# EAGLE design shield_draft (EAGLE 9.6.2)
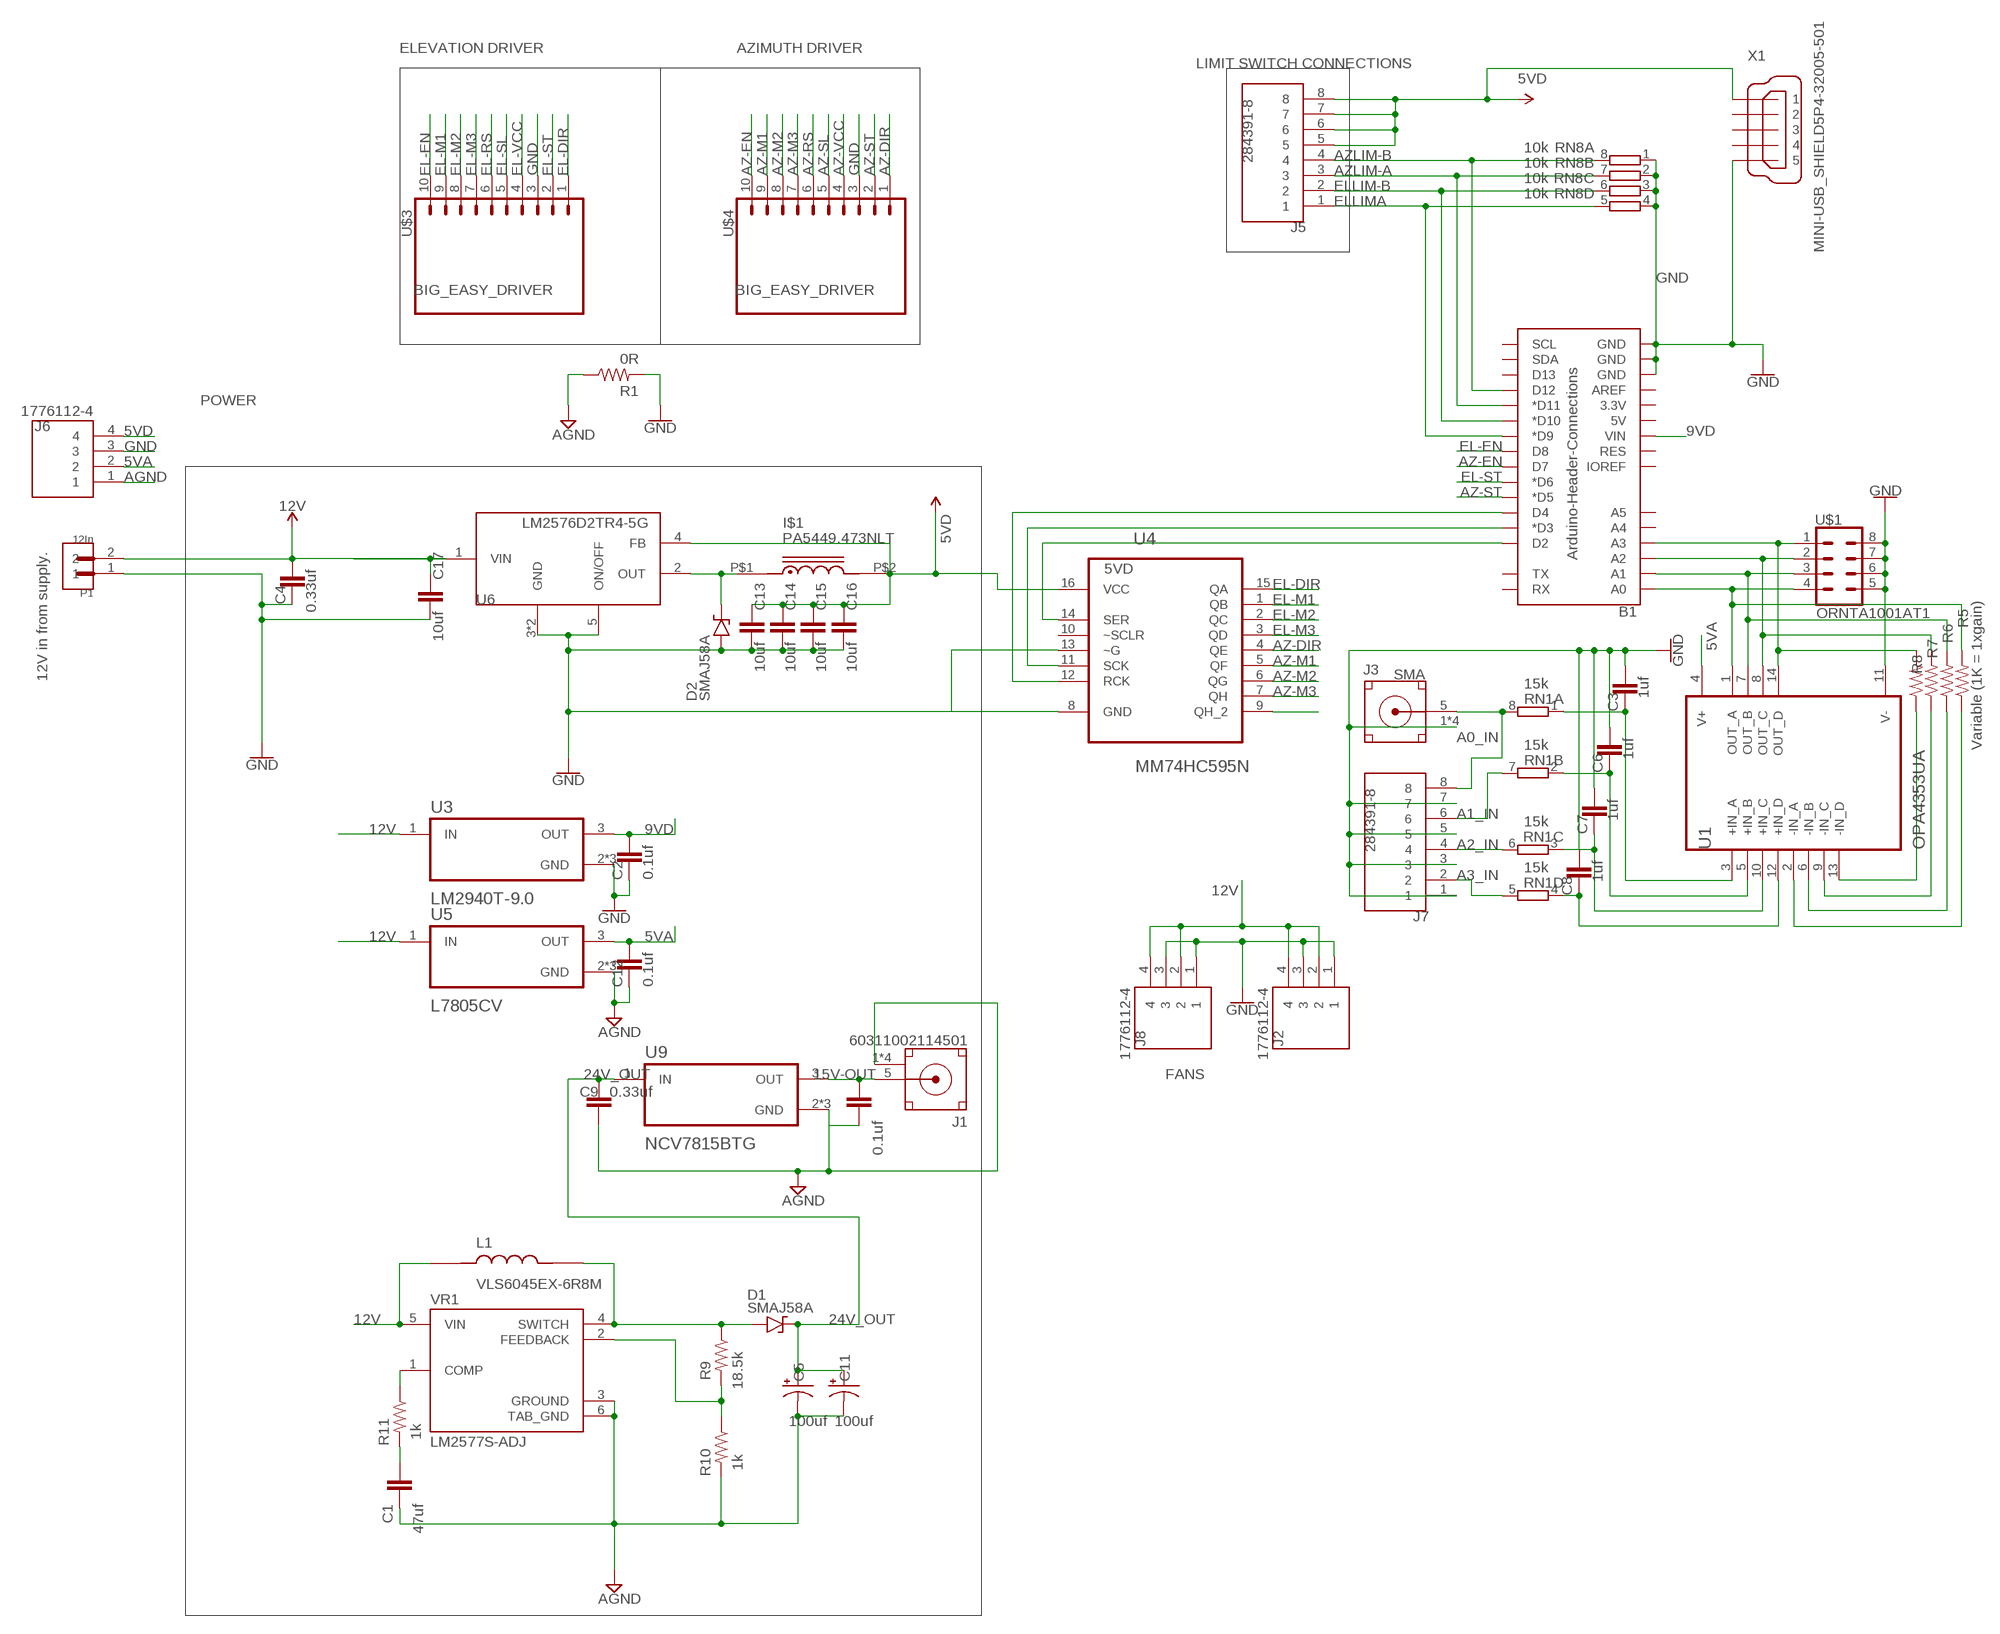
[diagram p0: schematic, sheet 1]

## Parts
B1  Arduino-Header-Connections  ARDUINO_UNO_R3_SHIELDBASIC  [UNO_R3_SHIELD]
C1  47uf  CC0805KRX7R9BB104  [CAP_0805]
C2  0.1uf  CC0805KRX7R9BB104  [CAP_0805]
C3  1uf  CC0805KRX7R9BB104  [CAP_0805]
C4  0.33uf  CC0805KRX7R9BB104  [CAP_0805]
C5  100uf  CAPACITOR-PE5-10.5  [E5-10,5]
C6  1uf  CC0805KRX7R9BB104  [CAP_0805]
C7  1uf  CC0805KRX7R9BB104  [CAP_0805]
C8  1uf  CC0805KRX7R9BB104  [CAP_0805]
C9  0.33uf  CC0805KRX7R9BB104  [CAP_0805]
C10  0.1uf  CC0805KRX7R9BB104  [CAP_0805]
C11  100uf  CAPACITOR-PE5-10.5  [E5-10,5]
C12  0.1uf  CC0805KRX7R9BB104  [CAP_0805]
C13  10uf  39NF-0805-50V-10%  [0805]
C14  10uf  39NF-0805-50V-10%  [0805]
C15  10uf  39NF-0805-50V-10%  [0805]
C16  10uf  39NF-0805-50V-10%  [0805]
C17  10uf  39NF-0805-50V-10%  [0805]
D1  SMAJ58A  [SMA]
D2  SMAJ58A  [SMA]
I$1  PA5449.473NLT  PULSE_ELECTRONICS_INDUCTOR  [IND_TYS4020470M-10]
J1  60311002114501  [60311002114501]
J2  1776112-4  [TE_1776112-4]
J3  SMA  60311002114501  [60311002114501]
J5  284391-8  [TE_284391-8]
J6  1776112-4  [TE_1776112-4]
J7  284391-8  [TE_284391-8]
J8  1776112-4  [TE_1776112-4]
L1  VLS6045EX-6R8M  [IND_VLS6045EX-6R8M]
P1  12In  OSTTE020104  [OST_OSTTE020104]
R1  0R  1OHM-0603-1/10W-1%  [0603]
R5  Variable (1K = 1xgain)  R-US_AXIAL-11.7MM-PITCH  [RESAD1176W63L850D250B]
R6  Var  R-US_AXIAL-11.7MM-PITCH  [RESAD1176W63L850D250B]
R7  Var  R-US_AXIAL-11.7MM-PITCH  [RESAD1176W63L850D250B]
R8  Var  R-US_AXIAL-11.7MM-PITCH  [RESAD1176W63L850D250B]
R9  18.5k  1OHM-0603-1/10W-1%  [0603]
R10  1k  1OHM-0603-1/10W-1%  [0603]
R11  1k  1OHM-0603-1/10W-1%  [0603]
RN1  15k  0016_064R_10K_/_CAY16-103J4LF  [CAY16]
RN8  10k  0016_064R_10K_/_CAY16-103J4LF  [CAY16]
U1  OPA4353UA  [SOIC127P600X175-14N]
U3  LM2940T-9.0  [TO254P1054X470X1955-3]
U4  MM74HC595N  [DIP254P762X533-16]
U5  L7805CV  LM2940T-9.0  [TO254P1054X470X1955-3]
U6  LM2576D2TR4-5G  [D2PAK-5]
U9  NCV7815BTG  LM2940T-9.0  [TO254P1054X470X1955-3]
U$1  ORNTA1001AT1  [SOIC127P600X175-8N]
U$3  BIG_EASY_DRIVER  [EASY_DRIVER_FTPRT]
U$4  BIG_EASY_DRIVER  [EASY_DRIVER_FTPRT]
VR1  LM2577S-ADJ  [TO170P1524X483-6N]
X1  MINI-USB_SHIELD5P4-32005-501  [32005-501]

## Nets
5VA: C12.2 J6.2 U1.4(V+) U5.3(OUT)
5VD: C13.1 C14.1 C15.1 C16.1 I$1.P$2 J5.5 J5.6 J5.7 J5.8 J6.4 U4.16(VCC) U6.4(FB) X1.1 ; supply symbol labelled 5V
9VD: B1.VIN C2.2 U3.3(OUT)
12V: C4.2 C17.1 J2.2 J2.4 J8.2 J8.4 L1.1 P1.2 U3.1(IN) U5.1(IN) U6.1(VIN) VR1.5(VIN)
15V-OUT: C10.2 J1.5(SIGNAL) U9.3(OUT)
24V_OUT: C5.+ C9.2 C11.+ D1.C U9.1(IN)
24V_PRE: D1.A L1.2 R9.1 VR1.4(SWITCH)
A0_IN: J3.5(SIGNAL) J7.8 RN1.8
A1_IN: J7.6 RN1.7
A2_IN: J7.4 RN1.6
A3_IN: J7.2 RN1.5
A_OUT: B1.A0 R5.2 U1.1(OUT_A) U$1.4(R4A)
AGND: C1.1 C5.- C9.1 C10.1 C11.- C12.1 J1.1(GND) J1.2(GND) J1.3(GND) J1.4(GND) J6.1 R1.1 R10.2 U5.2(GND) U5.P$1(GND) U5.P$2(GND) U9.2(GND) U9.P$1(GND) U9.P$2(GND) VR1.3(GROUND) VR1.6(TAB_GND)
AIN+: C3.1 RN1.1 U1.3(+IN_A)
AIN-: R5.1 U1.2(-IN_A)
AZ-DIR: U4.4(QE) U$4.1
AZ-EN: B1.D7 U$4.10
AZ-M1: U4.5(QF) U$4.9
AZ-M2: U4.6(QG) U$4.8
AZ-M3: U4.7(QH) U$4.7
AZ-RS: U$4.6
AZ-SL: U$4.5
AZ-ST: B1.D5(*D5) U$4.2
AZ-VCC: U$4.4
AZLIM-A: B1.D11(*D11) J5.3 RN8.7
AZLIM-B: B1.D12 J5.4 RN8.8
B_OUT: B1.A1 R6.2 U1.7(OUT_B) U$1.3(R3A)
BIN+: C6.1 RN1.2 U1.5(+IN_B)
BIN-: R6.1 U1.6(-IN_B)
C_OUT: B1.A2 R7.2 U1.8(OUT_C) U$1.2(R2A)
CIN+: C7.1 RN1.3 U1.10(+IN_C)
CIN-: R7.1 U1.9(-IN_C)
D_OUT: B1.A3 R8.2 U1.14(OUT_D) U$1.1(R1A)
DIN+: C8.1 RN1.4 U1.12(+IN_D)
DIN-: R8.1 U1.13(-IN_D)
EL-DIR: U4.15(QA) U$3.1
EL-EN: B1.D8 U$3.10
EL-M1: U4.1(QB) U$3.9
EL-M2: U4.2(QC) U$3.8
EL-M3: U4.3(QD) U$3.7
EL-RS: U$3.6
EL-SL: U$3.5
EL-ST: B1.D6(*D6) U$3.2
EL-VCC: U$3.4
ELLIM-B: B1.D10(*D10) J5.2 RN8.6
ELLIMA: B1.D9(*D9) J5.1 RN8.5
GND: B1.GND@0(GND) B1.GND@1(GND) B1.GND@2(GND) C2.1 C3.2 C4.1 C6.2 C7.2 C8.2 C13.2 C14.2 C15.2 C16.2 C17.2 D2.A J2.1 J2.3 J3.1(GND) J3.2(GND) J3.3(GND) J3.4(GND) J6.3 J7.1 J7.3 J7.5 J7.7 J8.1 J8.3 P1.1 R1.2 RN8.1 RN8.2 RN8.3 RN8.4 U1.11(V-) U3.2(GND) U3.P$1(GND) U3.P$2(GND) U4.8(GND) U4.13(~G) U6.3(GND) U6.5(ON/OFF) U6.6(GND) U$1.5(R4B) U$1.6(R3B) U$1.7(R2B) U$1.8(R1B) U$3.3 U$4.3 X1.5
N$1: B1.D2 U4.14(SER)
N$4: R9.2 R10.1 VR1.2(FEEDBACK)
N$5: D2.C I$1.P$1 U6.2(OUT)
N$6: R11.1 VR1.1(COMP)
N$7: C1.2 R11.2
N$10: B1.D3(*D3) U4.11(SCK)
N$11: B1.D4 U4.12(RCK)
N$12: U4.9(QH_2)
Unconnected: B1.3.3V B1.5V B1.A4 B1.A5 B1.AREF B1.D13 B1.IOREF B1.RES B1.RX B1.SCL B1.SDA B1.TX U4.10(~SCLR) X1.2 X1.3 X1.4 X1.M1(S1) X1.M2(S2) X1.M3(S3) X1.M4(S4)

## Notes on the sheet
- ELEVATION DRIVER | AZIMUTH DRIVER
- LIMIT SWITCH CONNECTIONS
- POWER
- 12V in from supply.
- FANS

## Library data of the parts
B1 = SparkFun-Boards:ARDUINO_UNO_R3_SHIELD: Arduino R3 Shield Footprint Shield form compatible with the Arduino Uno R3. SparkFun Products: MG2639 Cellular Shield <https://www.sparkfun.com/products/13120> MIDI Shield <https://www.sparkfun.com/products/12898> R3 Stackable Headers Kit <https://www.sparkfun.com/products/11417>
C1-C4 C6-C10 C12 = Resistor_Capacitor:CC0805KRX7R9BB104: CAP CER 0.1UF 50V X7R 0805 Manufacturer's datasheet <http://www.yageo.com/documents/recent/UPY-GPHC_X7R_6.3V-to-50V_18.pdf>; CREATED_BY: PCBLayout.com; DIGIKEY_PART_NUMBER: 311-1140-2-ND; MANUFACTURER: Yageo; MPN: CC0805KRX7R9BB104; PACKAGE: SMD 0805
C5 C11 = BeagleBone_Blue_R3:CAPACITOR-P: POLARIZED CAPACITOR, American symbol
C13-C17 = SparkFun-Capacitors:39NF: 39nF ceramic capacitors A capacitor is a passive two-terminal electrical component used to store electrical energy temporarily in an electric field.; PROD_ID: CAP-15816; VALUE: 39nF
D1 D2 = SMAJ58A:SMAJ58A: Check prices <https://pricing.snapeda.com/parts/SMAJ58A/Littelfuse%20Inc./view-part?ref=eda>; AVAILABILITY: Good; DESCRIPTION: 93.6V Clamp 4.3A Ipp Tvs Diode Surface Mount DO-214AC (SMA); MF: Littelfuse Inc.; MP: SMAJ58A; PACKAGE: DO-214AC-214 Littelfuse Inc.; PRICE: None; PURCHASE-URL: https://pricing.snapeda.com/search/part/SMAJ58A/?ref=eda
I$1 = pulse_electronics_inductor:PULSE_ELECTRONICS_INDUCTOR
J1 J3 = Coaxial Connectors:60311002114501: SMA PCB THT JACK RIGHT ANGLE - W Manufacturer's datasheet <https://katalog.we-online.com/em/datasheet/60311002114501.pdf>; CREATED_BY: PCBLayout.com; DIGIKEY_PART_NUMBER: 732-13833-ND; MANUFACTURER: Wurth Electronics Inc.; MPN: 60311002114501
J2 J6 J8 = 1776112-4:1776112-4: Check prices <https://pricing.snapeda.com/parts/1776112-4/TE%20Connectivity/view-part?ref=eda>; AVAILABILITY: In Stock; CENTERLINE_PITCH: 3.5 mm[.138 in]; COMMENT: 1776112-4; DESCRIPTION: 4 Position Wire to Board Terminal Block Horizontal with Board 0.138 (3.50mm) Through Hole; MF: TE Connectivity; MP: 1776112-4; NUMBER_OF_POSITIONS: 4; PACKAGE: None; PRICE: None; PURCHASE-URL: https://pricing.snapeda.com/search/part/1776112-4/?ref=eda
J5 J7 = 284391-8:284391-8: Check prices <https://pricing.snapeda.com/parts/284391-8/TE%20Connectivity/view-part?ref=eda>; AVAILABILITY: In Stock; COMMENT: 284391-8; DESCRIPTION: 8 Position Wire to Board Terminal Block Horizontal with Board 0.138 (3.50mm) Through Hole; EU_ROHS_COMPLIANCE: Compliant with Exemptions; MF: TE Connectivity; MP: 284391-8; PACKAGE: None; PRICE: None; PURCHASE-URL: https://pricing.snapeda.com/search/part/284391-8/?ref=eda
L1 = VLS6045EX:VLS6045EX-6R8M: 6.8µH Shielded Wirewound Inductor 3.6A 47mOhm Max Nonstandard Check prices <https://pricing.snapeda.com/parts/VLS6045EX6R8M/TDK/view-part?ref=eda>; AVAILABILITY: In Stock; DESCRIPTION: Inductor Power Shielded Wirewound 6.8uH 20% 100KHz Ferrite 3.6A 0.0468Ohm DCR 2424 T/R; MF: TDK; MP: VLS6045EX6R8M; PACKAGE: None; PRICE: None; PURCHASE-URL: https://pricing.snapeda.com/search/part/VLS6045EX6R8M/?ref=eda
P1 = 2-pin 3.5mm pitch:OSTTE020104: Terminal Block 3.5mm 2pos Pcb Check prices <https://pricing.snapeda.com/parts/OSTTE020104/On%20Shore/view-part?ref=eda>; AVAILABILITY: Not in stock; DESCRIPTION: 2 Position Wire to Board Terminal Block Horizontal with Board 0.138 (3.50mm) Through Hole; MF: On Shore; MP: OSTTE020104; PACKAGE: None; PRICE: None; PURCHASE-URL: https://pricing.snapeda.com/search/part/OSTTE020104/?ref=eda
R1 R9-R11 = SparkFun-Resistors:1OHM: 1Ω resistor A resistor is a passive two-terminal electrical component that implements electrical resistance as a circuit element. Resistors act to reduce current flow, and, at the same time, act to lower voltage levels within circuits. - Wikipedia; PROD_ID: RES-08269; VALUE: 1
R5-R8 = Tutorial - Fusion 360:R-US: Resistor Fixed - ANSI; CATEGORY: Resistor; SUB-CATEGORY: Fixed
RN1 = Resistenze:0016_064R_10K_/_CAY16-103J4LF: 10K 064 R; CASE: SMD_3,2x1,6; MONTHLY_USAGE: _____; PART_NUMBER: 064R_10K_/_CAY16-103J4LF; PRICE: _____; SUPPLIER: _____; TYPE: Resistenze; VALUE: 10k
RN8 = Resistenze:0016_064R_10K_/_CAY16-103J4LF: 10K 064 R; CASE: SMD_3,2x1,6; MONTHLY_USAGE: _____; PART_NUMBER: 064R_10K_/_CAY16-103J4LF; PRICE: _____; SUPPLIER: _____; TYPE: Resistenze
U1 = OPA4353UA:OPA4353UA: Check prices <https://pricing.snapeda.com/parts/OPA4353UA/Texas%20Instruments/view-part?ref=eda>; AVAILABILITY: Warning; DESCRIPTION: Quad high-speed, single-supply, rail-to-rail operational amplifiers MicroAmplifier&trade; series< 14-SOIC; MF: Texas Instruments; MP: OPA4353UA; PACKAGE: SOIC-14 Texas Instruments; PRICE: None; PURCHASE-URL: https://pricing.snapeda.com/search/part/OPA4353UA/?ref=eda
U3 U5 U9 = LM2940T-9.0:LM2940T-9.0: Check prices <https://pricing.snapeda.com/parts/LM2940T-9.0/NOPB/Texas%20Instruments/view-part?ref=eda>; AVAILABILITY: In Stock; DESCRIPTION: 1-A, 26-V, high-PSRR, low-dropout voltage regulator 3-TO-220 -40 to 125; MF: Texas Instruments; MP: LM2940T-9.0/NOPB; PACKAGE: TO-220-3 Texas Instruments; PRICE: None; PURCHASE-URL: https://pricing.snapeda.com/search/part/LM2940T-9.0/NOPB/?ref=eda
U4 = MM74HC595N:MM74HC595N: 8-BIT SHIFT REGISTER Check prices <https://pricing.snapeda.com/parts/MM74HC595N/ON%20Semiconductor/view-part?ref=eda>; AVAILABILITY: Warning; DESCRIPTION: Shift Shift Register 1 Element 8 Bit 16-PDIP; MF: ON Semiconductor; MP: MM74HC595N; PACKAGE: PDIP-16 ON Semiconductor; PRICE: None; PURCHASE-URL: https://pricing.snapeda.com/search/part/MM74HC595N/?ref=eda
U6 = LM2576D2TR4-5G:LM2576D2TR4-5G: http://octopart.com/lm2576d2tr4-5g-on+semiconductor-46514222 Check prices <https://pricing.snapeda.com/parts/LM2576D2TR4-5G/ON%20Semiconductor/view-part?ref=eda>; AVAILABILITY: In Stock; DESCRIPTION: Buck Switching Regulator IC Positive or Negative Fixed 5V 1 Output 3A TO-263-6, D²Pak (5 Leads + Tab), TO-263BA; MF: ON Semiconductor; MP: LM2576D2TR4-5G; PACKAGE: D2PAK-5 ON Semiconductor; PRICE: None; PURCHASE-URL: https://pricing.snapeda.com/search/part/LM2576D2TR4-5G/?ref=eda
U$1 = 8pin quad resistor:ORNTA1001AT1
U$3 U$4 = easy_driver:BIG_EASY_DRIVER
VR1 = LM2577S-ADJ:LM2577S-ADJ: Check prices <https://pricing.snapeda.com/parts/LM2577S-ADJ/Texas%20Instruments/view-part?ref=eda>; AVAILABILITY: In Stock; DESCRIPTION: SIMPLE SWITCHER&reg; 3.5V to 40V, 3A Low Component Count Step-Up Regulator 5-DDPAK/TO-263 -40 to 125; MF: Texas Instruments; MP: LM2577S-ADJ; PACKAGE: TO-263-5 Texas Instruments; PRICE: None; PURCHASE-URL: https://pricing.snapeda.com/search/part/LM2577S-ADJ/?ref=eda
X1 = con-cypressindustries:MINI-USB_SHIELD5P4-: MINI USB-B R/A W/O POST 5 pol. Source: www.cypressindustries.com; OC_FARNELL: unknown; OC_NEWARK: unknown

## Board
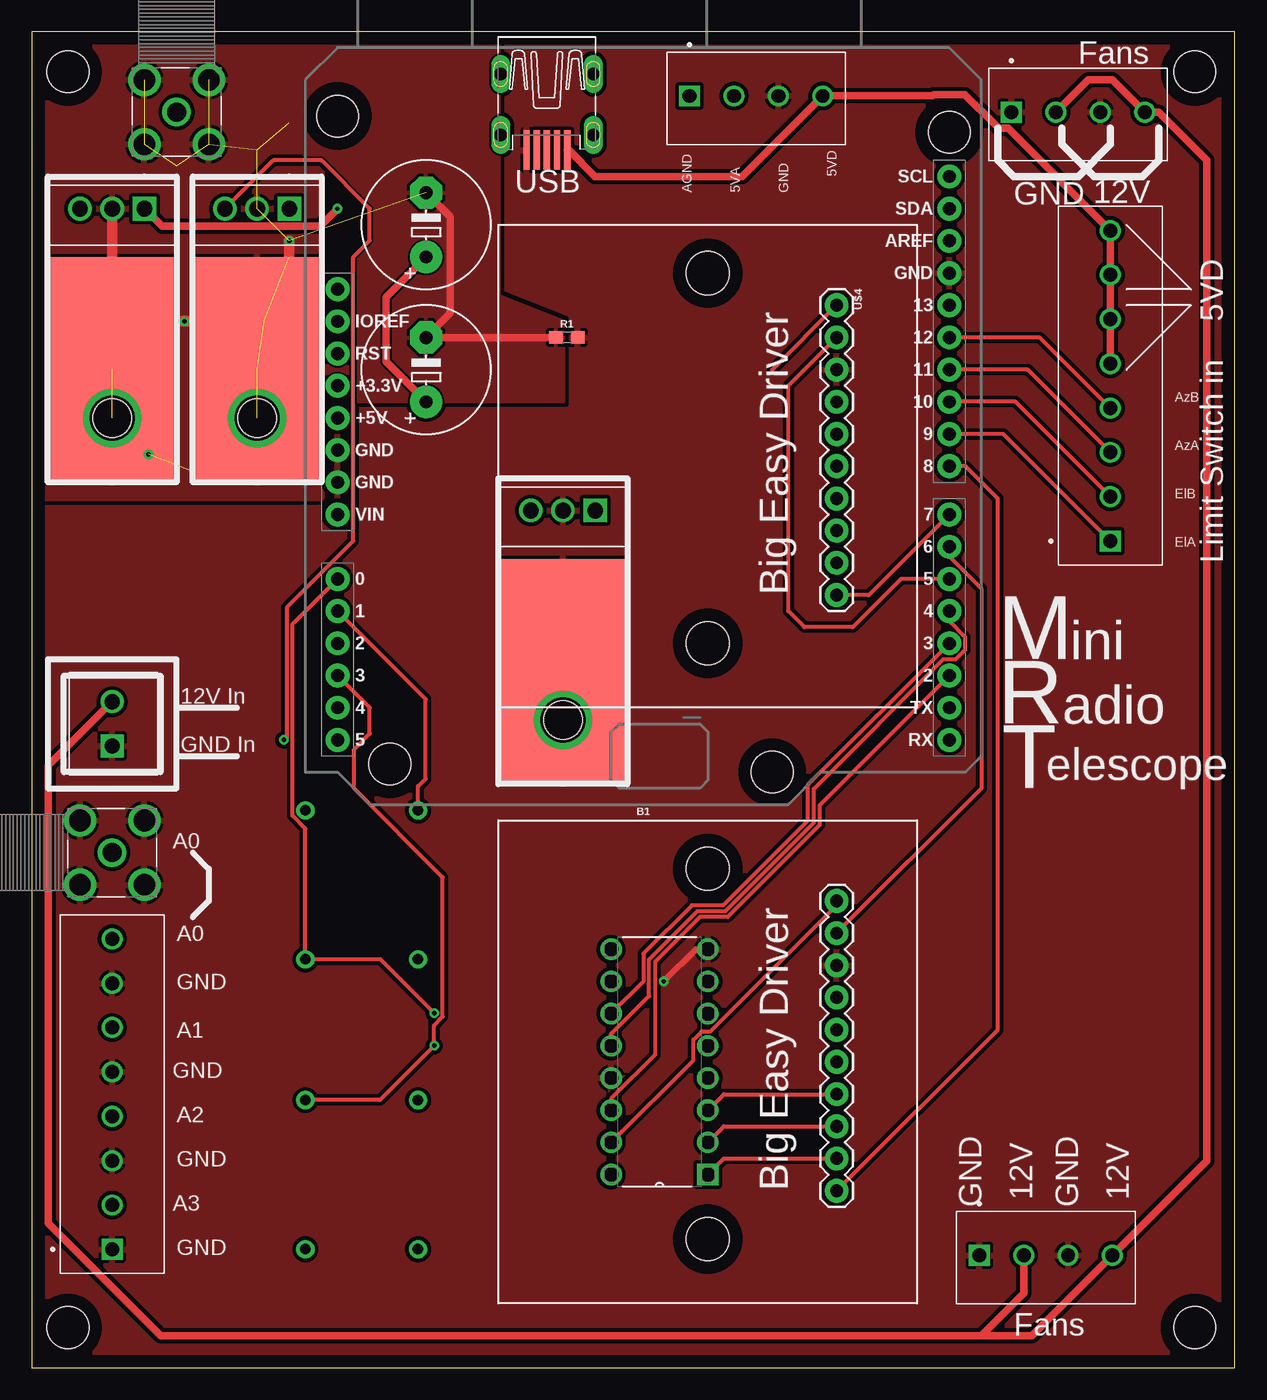
[diagram p1: board, top side]
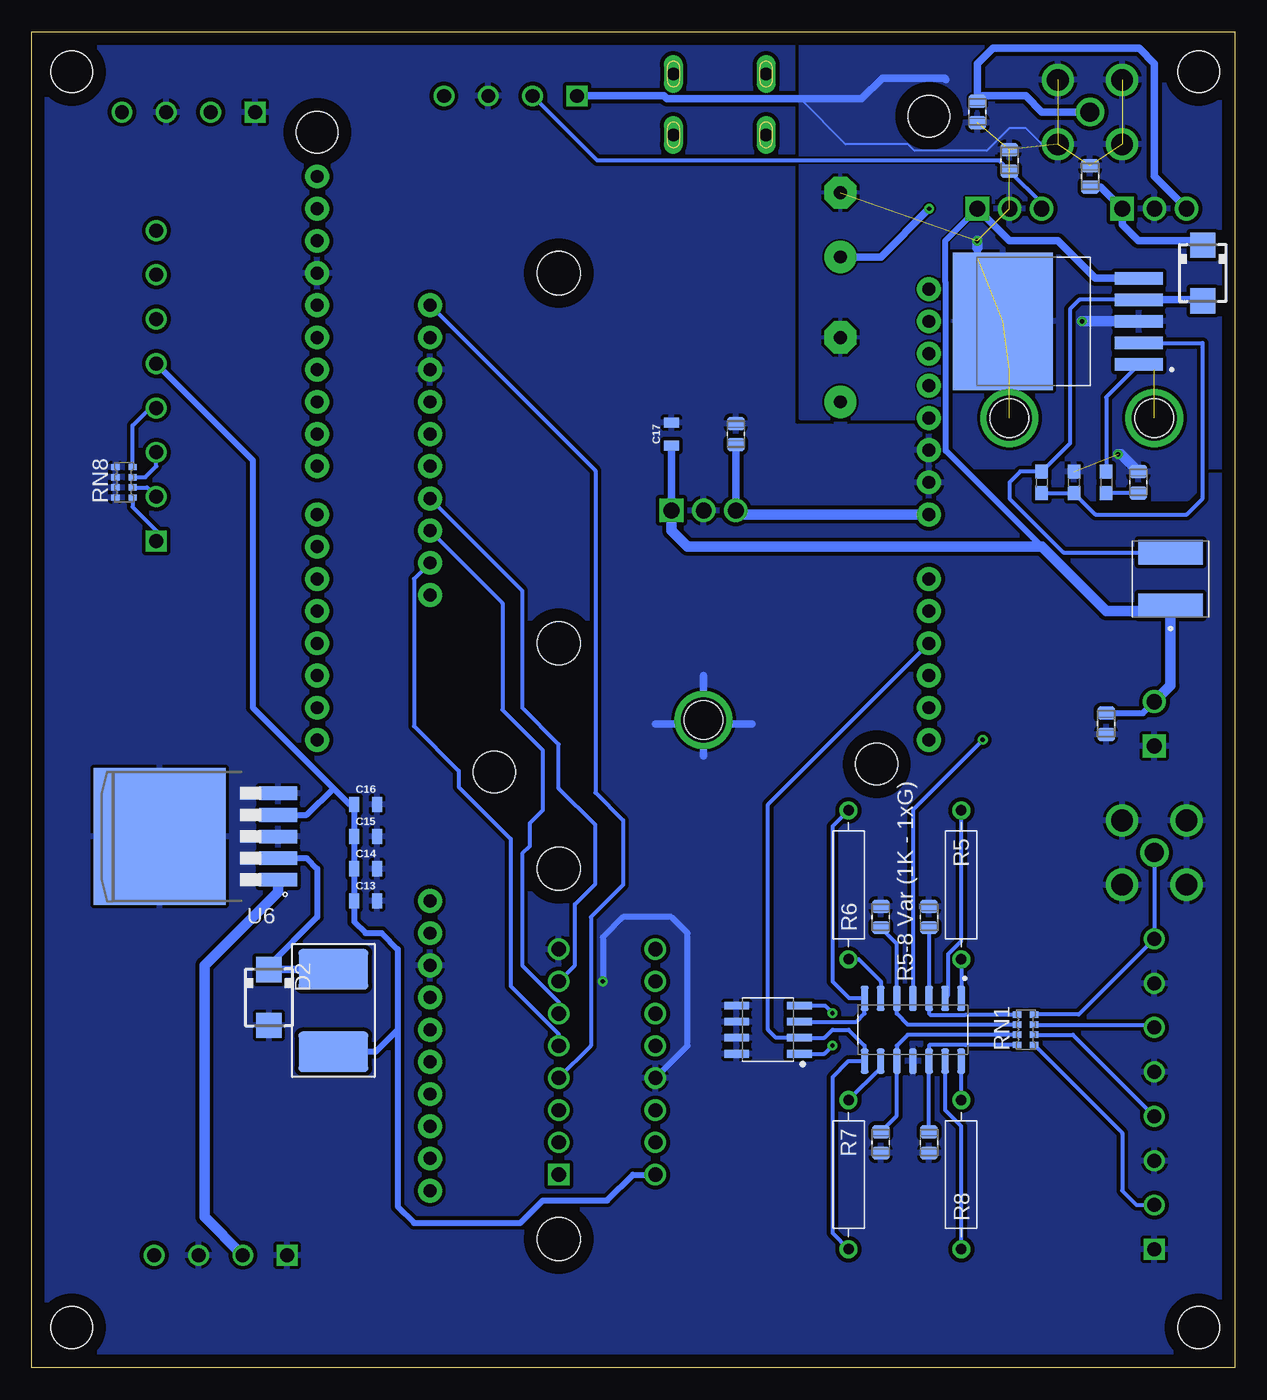
[diagram p2: board, bottom side, seen from below]

Size 94.92 x 105.4 mm. Coordinates in mm from the lower left corner, seen from the top.
Outline: 0,0 94.92,0 94.92,105.4 0,105.4 0,0
Copper layers (1*16): Top 0.035mm / dielectric 1.5mm / Bottom 0.035mm
Design rules "default": minimum track width 6mil, minimum drill 0.35mm, track to track 6mil, track to pad 6mil, pad to pad 6mil, via to via 6mil, smd to smd 6mil, copper to edge 40mil, drill to drill 6mil, minimum pad ring 10mil, minimum via ring 8mil, stop-mask expansion 4mil, vias tented up to drill 0mil, thermal gap 10mil

### Footprints (pad centres in the part's own frame; a part is rotated, then mirrored left to right if it is on the bottom)
UNO_R3_SHIELD = drill 1.016 pad 1.88: 3.3V 24.13,-2.54; 5V 24.13,0; A0 24.13,12.7; A1 24.13,15.24; A2 24.13,17.78; A3 24.13,20.32; A4 24.13,22.86; A5 24.13,25.4; AREF -24.13,-13.97; D2 -24.13,20.32; D3 -24.13,17.78; D4 -24.13,15.24; D5 -24.13,12.7; D6 -24.13,10.16; D7 -24.13,7.62; D8 -24.13,3.81; D9 -24.13,1.27; D10 -24.13,-1.27; D11 -24.13,-3.81; D12 -24.13,-6.35; D13 -24.13,-8.89; GND@0 24.13,2.54; GND@1 24.13,5.08; GND@2 -24.13,-11.43; IOREF 24.13,-7.62; NC 24.13,-10.16; RES 24.13,-5.08; RX -24.13,25.4; SCL -24.13,-19.05; SDA -24.13,-16.51; TX -24.13,22.86; VIN 24.13,7.62
CAP_0805 = smd 1.05 x 1.38: 1 -0.84,0; 2 0.84,0
E5-10,5 = drill 1.016 pad 2.54: + -2.54,0 | drill 1.016 pad 2.54 octagon: - 2.54,0
0805 = smd 0.8 x 1.2: 1 -0.9,0; 2 0.9,0
SMA = smd 2 x 2: A 2.2,0; C -2.2,0
IND_TYS4020470M-10 = smd 3.2 x 5.5: P$1 -3.5,0; P$2 3,0
60311002114501 = drill 1.7: 1 -2.54,2.54; 2 2.54,2.54; 3 -2.54,-2.54; 4 2.54,-2.54 | drill 1.5: 5 0,0
TE_1776112-4 = drill 1.1 square: 1 -5.25,0 | drill 1.1: 2 -1.75,0; 3 1.75,0; 4 5.25,0
TE_284391-8 = drill 1.1 square: 1 -12.25,0 | drill 1.1: 2 -8.75,0; 3 -5.25,0; 4 -1.75,0; 5 1.75,0; 6 5.25,0; 7 8.75,0; 8 12.25,0
STAND-OFF = hole 3.302: 0,0
IND_VLS6045EX-6R8M = smd 1.9 x 5.1: 1 -2.1,0; 2 2.1,0
OST_OSTTE020104 = drill 1.2 square: 1 -1.75,0 | drill 1.2: 2 1.75,0
0603 = smd 1.1 x 1: 1 -0.85,0; 2 0.85,0
RESAD1176W63L850D250B = drill 0.83 pad 1.43: 1 -5.88,0; 2 5.88,0
CAY16 = smd 0.5 x 0.65: 1 -1.2,-0.675; 2 -0.4,-0.675; 3 0.4,-0.675; 4 1.2,-0.675; 5 1.2,0.675; 6 0.4,0.675; 7 -0.4,0.675; 8 -1.2,0.675
SOIC127P600X175-14N = smd 1.97 x 0.6: 1 -2.475,3.81; 2 -2.475,2.54; 3 -2.475,1.27; 4 -2.475,0; 5 -2.475,-1.27; 6 -2.475,-2.54; 7 -2.475,-3.81; 8 2.475,-3.81; 9 2.475,-2.54; 10 2.475,-1.27; 11 2.475,0; 12 2.475,1.27; 13 2.475,2.54; 14 2.475,3.81
TO254P1054X470X1955-3 = drill 1.24 square: 1 2.54,8.89 | drill 1.24: 2 0,8.89; 3 -2.54,8.89 | drill 3.556: P$1 0,-7.62 | smd 10.16 x 17.78: P$2 0,-3.81 | hole 3.048: 0,-7.62
DIP254P762X533-16 = drill 1.118 square: 1 -7.62,17.78 | drill 1.118: 2 -7.62,15.24; 3 -7.62,12.7; 4 -7.62,10.16; 5 -7.62,7.62; 6 -7.62,5.08; 7 -7.62,2.54; 8 -7.62,0; 9 0,0; 10 0,2.54; 11 0,5.08; 12 0,7.62; 13 0,10.16; 14 0,12.7; 15 0,15.24; 16 0,17.78
D2PAK-5 = smd 3 x 1.067: 1 -4.521,3.404; 2 -4.521,1.702; 3 -4.521,0; 4 -4.521,-1.702; 5 -4.521,-3.404 | smd 10.41 x 10.8: 6 4.81,0
SOIC127P600X175-8N = smd 1.968 x 0.599: 1 -2.473,1.905; 2 -2.473,0.635; 3 -2.473,-0.635; 4 -2.473,-1.905; 5 2.473,-1.905; 6 2.473,-0.635; 7 2.473,0.635; 8 2.473,1.905
EASY_DRIVER_FTPRT = drill 1.016 pad 1.88: 1 11.43,12.7; 2 11.43,10.16; 3 11.43,7.62; 4 11.43,5.08; 5 11.43,2.54; 6 11.43,0; 7 11.43,-2.54; 8 11.43,-5.08; 9 11.43,-7.62; 10 11.43,-10.16 | hole 3.429: 1.27,15.24; 1.27,-13.97
TO170P1524X483-6N = smd 3.79 x 0.99: 1 -6.4,3.4; 2 -6.4,1.7; 3 -6.4,0; 4 -6.4,-1.7; 5 -6.4,-3.4 | smd 7.88 x 10.84: 6 4.35,0
32005-501 = smd 3.1 x 0.5: 1 3,1.6; 2 3,0.8; 3 3,0; 4 3,-0.8; 5 3,-1.6 | drill 1 pad 1.422 long: M1 -3,3.65; M2 -3,-3.65; M3 1.8,3.65; M4 1.8,-3.65

### Placement (x,y rotation side)
B1  48.26,74.93 180 top
C1  7.62,69.85 270 bottom
C2  39.37,73.66 270 bottom
C3  24.13,35.56 90 bottom
C4  10.16,50.8 90 bottom
C5  31.11,78.74 90 top
C6  27.94,35.56 90 bottom
C7  27.94,17.78 270 bottom
C8  24.13,17.78 270 bottom
C9  11.43,93.98 270 bottom
C10  20.32,99.06 90 bottom
C11  31.11,90.17 90 top
C12  17.78,95.25 270 bottom
C13  68.58,36.83 0 bottom
C14  68.58,39.37 0 bottom
C15  68.58,41.91 0 bottom
C16  68.58,44.45 0 bottom
C17  44.45,73.66 90 bottom
D1  2.54,86.36 270 bottom
D2  76.2,29.21 270 bottom
I$1  71.12,27.94 270 bottom
J1  11.43,99.06 180 top
J2  80.01,8.89 0 top
J3  6.35,40.64 270 top
J5  85.09,77.47 90 top
J6  57.15,100.33 0 top
J7  6.35,21.59 90 top
J8  82.55,99.06 0 top
JP1  STAND-OFF  [STAND-OFF]  72.39,97.47 90 top
JP2  STAND-OFF  [STAND-OFF]  24.13,98.74 90 top
JP3  STAND-OFF  [STAND-OFF]  91.76,3.18 90 top
JP4  STAND-OFF  [STAND-OFF]  2.86,3.18 90 top
JP5  STAND-OFF  [STAND-OFF]  2.86,102.23 90 top
JP6  STAND-OFF  [STAND-OFF]  28.26,47.62 90 top
JP7  STAND-OFF  [STAND-OFF]  91.76,102.23 90 top
JP10  STAND-OFF  [STAND-OFF]  58.42,46.99 90 top
L1  5.08,62.23 90 bottom
P1  6.35,50.8 90 top
R1  42.23,81.28 0 top
R5  21.59,38.1 270 bottom
R6  30.48,38.1 90 bottom
R7  30.48,15.24 270 bottom
R8  21.59,15.24 90 bottom
R9  15.24,69.85 270 bottom
R10  12.7,69.85 90 bottom
R11  10.16,69.85 270 bottom
RN1  16.51,26.67 270 bottom
RN8  87.63,69.85 270 bottom
U1  25.4,26.67 270 bottom
U3  41.91,58.74 0 top
U4  45.72,33.02 180 top
U5  17.78,82.55 0 top
U6  80.01,41.91 180 bottom
U9  6.35,82.55 0 top
U$1  36.83,26.67 180 bottom
U$3  52.07,24.13 0 top
U$4  52.07,71.12 0 top
VR1  13.97,82.55 180 bottom
X1  40.64,99.06 270 top

### Tracks (layer width: path | path; a pad name or v marks a point on that pad's centre or on a via)
5VA  (via drill 0.35)
  Top 0.305: U5.3 19.05,95.25 22.86,95.25 26.67,91.44 26.67,88.92 25.38,87.63 25.38,65.23 20.11,59.97 20.11,49.76 v19.89,49.53
  Bottom 0.305: U5.3 15.24,91.87 C12.2 18.62,95.25 50.32,95.25 J6.2 | v19.89,49.53 25.4,44.02 U1.4
5VD
  Top 0.61: J5.5 J5.6 J5.7 J5.8 77.03,97.78 76.29,97.78 76.02,98.05 73.62,100.44 71.16,100.44 71.05,100.33 J6.4 56.05,93.98 44.45,93.98 42.37,96.06 X1.1
  Bottom 0.457: 66.04,26.67 66.04,33.02 67.31,34.29 68.58,34.29 69.48,35.19 C13.1 C14.1 C15.1 C16.1 69.85,44.45 71.12,45.72 | 66.04,26.67 67.77,24.94 I$1.P$2 | J5.5 77.47,71.6 77.47,52.07 71.12,45.72 | U6.4 73.23,43.61 71.12,45.72 | 66.04,26.67 66.04,12.7 64.77,11.43 56.36,11.43 54.6,13.2 49.53,13.2 47.48,15.24 U4.16
9VD
  Bottom 0.61: C2.2 U3.3
  Bottom 0.813: U3.3 39.05,67.31 B1.VIN
12V
  Top 0.61: P1.2 1.32,47.52 1.32,11.38 10.16,2.54 74.93,2.54 | J2.4 85.09,9.06 | J2.4 78.91,2.54 74.93,2.54 | J2.4 92.71,16.34 92.71,95.25 88.9,99.06 J8.4 85.26,101.6 83.34,101.6 J8.2 | J2.2 78.26,5.87 74.93,2.54
  Bottom 0.457: C4.2 7.26,51.64 P1.2 | U5.1 22.86,88.9 22.86,85.69 22.81,85.64 22.81,72.34 15.24,64.77 13.97,63.5 | 5.08,59.69 L1.1
  Bottom 0.61: VR1.5 11.02,85.95 13.97,88.9 17.78,88.9 U5.1 | U3.1 C17.1
  Bottom 0.813: U3.1 44.45,66.04 43.18,64.77 15.24,64.77 10.16,59.69 5.08,59.69 5.08,53.82 P1.2 | J2.2 81.28,11.91 81.28,31.75 75.49,37.54 U6.1
15V-OUT
  Bottom 0.61: U9.3 6.38,94.01 6.38,102.84 6.35,102.87 7.56,104.08 19.11,104.08 20.32,102.87 C10.2 19.89,100.33 16.51,100.33 15.24,99.06 J1.5
24V_OUT  (via drill 0.35)
  Top 0.61: C5.+ 27.94,79.38 27.94,84.45 C11.+ | v24.13,91.44 22.74,90.05 10.28,90.05 U9.1
  Bottom 0.61: C9.2 10.59,93.14 U9.1 8.89,90.17 7.62,88.9 2.88,88.9 D1.C | C11.+ 27.94,87.63 v24.13,91.44
24V_PRE
  Bottom 0.305: VR1.4 12.27,84.25 13.02,83.5 13.02,72.92 R9.1 16.93,70.7 17.78,69.85 17.78,68.58 13.53,64.33 L1.2
  Bottom 0.61: D1.A 2.63,84.25 VR1.4
A0_IN
  Bottom 0.305: RN1.8 12.32,27.87 J7.8 J3.5
A1_IN
  Bottom 0.305: J7.6 6.58,27.07 RN1.7
A2_IN
  Bottom 0.305: RN1.6 12.78,26.27 J7.4
A3_IN
  Bottom 0.305: RN1.5 8.89,18.52 8.89,13.97 7.76,12.84 J7.2
A_OUT  (via drill 0.35)
  Top 0.305: v31.75,27.99 27.52,32.22 R5.2 21.59,42.54 20.57,43.56 20.57,58.67 B1.A0
  Bottom 0.305: R5.2 U1.1 | U$1.4 32.34,28.57 v31.75,27.99
AGND  (via drill 0.35)  (14 unrouted)
  Top 0.305: U9.P$2 8.89,78.74
  Top 0.61: C11.- 33.02,90.81 33.02,83.19 C5.- R1.1
  Top 0.813: 10.16,73.66 9.21,72.71 v9.21,72.07 9.21,73.62 9.3,73.71 9.3,76.15 7.57,77.88 7.21,77.88 U9.P$2 | U9.P$2 U9.2 | U9.P$2 6.35,79.38 9.53,82.55 v12.07,82.55 19.05,82.55 20.32,83.82 v20.32,88.9
  Bottom 0.152: J1.1 15.24,96.52 16.51,97.79 17.78,97.79 19.57,96 25.27,96 25.79,96.52 30.71,96.52 34.29,100.09
  Bottom 0.61: 22.79,101.6 22.9,101.71 27.83,101.71 29.45,100.09 34.29,100.09 44.79,100.09 45.03,100.33 J6.1 | v20.32,88.9 20.32,87.63
  Bottom 0.813: C1.1 9,72.07 v9.21,72.07 | VR1.3 v12.07,82.55 | 20.32,88.36 v20.32,88.9
  pour Bottom (isolate 0.305): 22.86,106.68 22.86,72.39 22.86,71.12 -1.27,71.12 -1.27,106.68
  pour Top (isolate 0.305): -1.27,106.68 22.86,106.68 22.86,68.58 -1.27,68.58
  pour Bottom (isolate 0.305): 1.27,71.12 3.81,68.58 20.32,68.58 22.86,71.12 22.86,73.66 1.27,73.66
  pour Top: 21.59,106.68 36.83,106.68 36.83,84.58 41.91,82.55 41.91,76.2 21.59,76.2
  pour Bottom: 19.05,107.95 34.29,107.95 34.29,74.93 20.32,74.93 19.05,76.2
AIN+
  Bottom 0.305: RN1.1 21.24,27.87 21.25,27.86 24.04,27.86 24.13,27.94 U1.3 C3.1
AIN-
  Bottom 0.305: R5.1 21.59,33.66 22.61,32.64 22.61,29.39 U1.2
AZ-DIR
  Top 0.305: U$4.1 58.42,78.74
  Bottom 0.305: U4.4 50.8,25.4 50.8,35.56 48.26,38.1 48.26,43.18 50.46,45.38 50.46,70.78 U$4.1
AZ-EN
  Top 0.305: B1.D7 66.04,60.96 U$4.10
AZ-M1
  Bottom 0.305: U4.5 53.34,26.32 57.14,30.12 57.14,41.72 61.24,45.82 61.24,47.09 64.77,50.62 64.77,62.23 U$4.9
AZ-M2
  Bottom 0.305: U4.6 53.34,28.86 56.22,31.75 56.22,40.56 55.64,41.14 55.64,42.95 54.61,43.98 54.61,48.73 57.78,51.91 57.78,60.33 U$4.8
AZ-M3
  Bottom 0.305: U$4.7 56.22,61.3 56.22,52.07 53.34,49.19 53.34,45.72 50.46,42.84 50.46,38.18 52.07,36.56 52.07,31.75 U4.7
AZ-ST
  Top 0.305: B1.D5 68.58,62.23 64.77,58.42 60.96,58.42 59.69,59.69 59.69,77.47 U$4.2
AZLIM-A
  Top 0.305: J5.3 78.57,78.74 B1.D11
  Bottom 0.305: RN8.7 85.96,70.25 85.09,71.12 J5.3
AZLIM-B
  Top 0.305: J5.4 79.53,81.28 B1.D12
  Bottom 0.305: RN8.8 86.96,74.33 85.57,75.72 J5.4
B_OUT
  Top 0.305: R6.2 30.48,45.86 31.08,46.46 31.08,52.74 B1.A1
  Bottom 0.305: U$1.3 29.84,27.3 29.21,27.94 U1.7 29.24,29.18 30.45,29.18 31.75,30.48 31.75,42.71 R6.2
BIN+
  Bottom 0.305: RN1.2 25.8,27.07 26.67,27.94 U1.5 26.67,33.45 C6.1
BIN-
  Bottom 0.305: R6.1 29.68,32.22 27.94,30.48 U1.6
C_OUT
  Bottom 0.305: R7.2 31.75,10.63 31.75,22.93 30.48,24.2 U1.8 29.21,25.4 30.48,26.67 31.75,26.67 32.38,26.04 U$1.2 36.2,26.04 36.83,26.67 36.83,44.45 B1.A2
CIN+
  Bottom 0.305: RN1.3 25.8,26.27 26.67,25.4 U1.10 26.67,19.89 C7.1
CIN-
  Bottom 0.305: R7.1 27.94,23.66 U1.9
D_OUT  (via drill 0.35)
  Top 0.305: R8.2 27.47,21.12 v31.75,25.4 31.75,27.02 32.43,27.71 32.43,38.69 25.44,45.68 25.44,48.79 26.67,50.02 26.67,52.07 B1.A3
  Bottom 0.305: R8.2 U1.14 | U$1.1 32.38,24.77 v31.75,25.4
DIN+
  Bottom 0.305: RN1.4 21.24,25.47 21.25,25.48 24.04,25.48 24.13,25.4 U1.12 C8.1
DIN-
  Bottom 0.305: R8.1 21.59,19.05 22.86,20.32 U1.13
EL-DIR
  Top 0.305: U4.15 52.2,24.26 52.2,25.87 52.87,26.54 53.56,26.54 63.5,36.48 U$3.1
EL-EN
  Top 0.305: U$3.10 76.2,26.67 76.2,68.58 73.66,71.12 B1.D8
EL-M1
  Top 0.305: U4.1 54.61,16.51 U$3.9
EL-M2
  Top 0.305: U4.2 54.61,19.05 U$3.8
EL-M3
  Top 0.305: U4.3 54.61,21.59 U$3.7
EL-ST
  Top 0.305: B1.D6 72.39,63.99 74.91,61.48 74.91,45.7 U$3.2
ELLIM-B
  Top 0.305: J5.2 77.61,76.2 B1.D10
  Bottom 0.305: RN8.6 85.82,69.45 J5.2
ELLIMA
  Top 0.305: J5.1 76.65,73.66 B1.D9
  Bottom 0.305: RN8.5 86.96,67.91 85.09,66.04 J5.1
GND  (via drill 0.35)
  Top 0.457: v49.86,30.48 52.4,33.02 U4.8
  Bottom 0.457: U4.13 43.18,25.4 43.18,34.29 44.45,35.56 48.26,35.56 49.86,33.96 v49.86,30.48
  Bottom 0.61: U3.P$1 41.91,54.61 | U3.P$1 42.23,50.8 45.72,50.8 | U3.P$1 41.91,48.26 | U3.P$1 41.59,50.8 38.1,50.8
  pour Top (isolate 0.305, rank 2): -1.27,109.22 99.06,109.22 99.06,-3.81 -2.54,-3.81 -2.54,109.22
  pour Bottom (isolate 0.305, rank 2): -1.27,111.76 100.33,111.76 100.33,-5.08 -5.08,-5.08 -5.08,111.76
N$1
  Top 0.305: B1.D2 62.15,44.37 62.15,42.81 54.9,35.56 52.72,35.56 49.17,32.02 49.17,24.7 45.72,21.24 U4.14
N$4
  Bottom 0.305: VR1.2 2.54,80.85 2.54,68.58 3.81,67.31 11.01,67.31 R10.1 R9.2
N$5
  Bottom 0.457: U6.2 73.23,40.21 72.39,39.37 72.39,35.56 76.2,31.75 D2.C
  Bottom 0.61: D2.C 76.17,31.44 I$1.P$1
N$6
  Bottom 0.305: VR1.1 10.16,76.56 R11.1
N$7
  Bottom 0.305: C1.2 R11.2
N$10
  Top 0.305: 72.39,56.37 B1.D3 61.24,46 61.24,43.19 54.53,36.49 52.07,36.49 48.26,32.68 48.26,30.48 U4.11
N$11
  Top 0.305: U4.12 45.72,26.32 48.72,29.32 48.72,32.21 52.54,36.03 54.72,36.03 61.7,43 61.7,45.68 71.9,55.88 72.88,55.88 73.64,56.63 73.64,57.67 72.39,58.91 B1.D4

### Text on the board
tPlace: Fans | 5VD | 12V | AGND | 5VA | GND | GND | AzB | AzA | ElA | 12V | 12V | GND | GND | Fans
tNames: USB | 5VD | ElB | Limit Switch in | Big Easy Driver | M | ini | 12V In | R | adio | GND In | T | elescope | A0 | A0 | GND | A1 | GND | A2 | GND | Big Easy Driver | A3 | GND
bNames: R5-8 Var (1K - 1xG)
tDocu: 15V OUT | GND
bDocu: 1K | R-array